# Altium project EL6905.PrjPcb
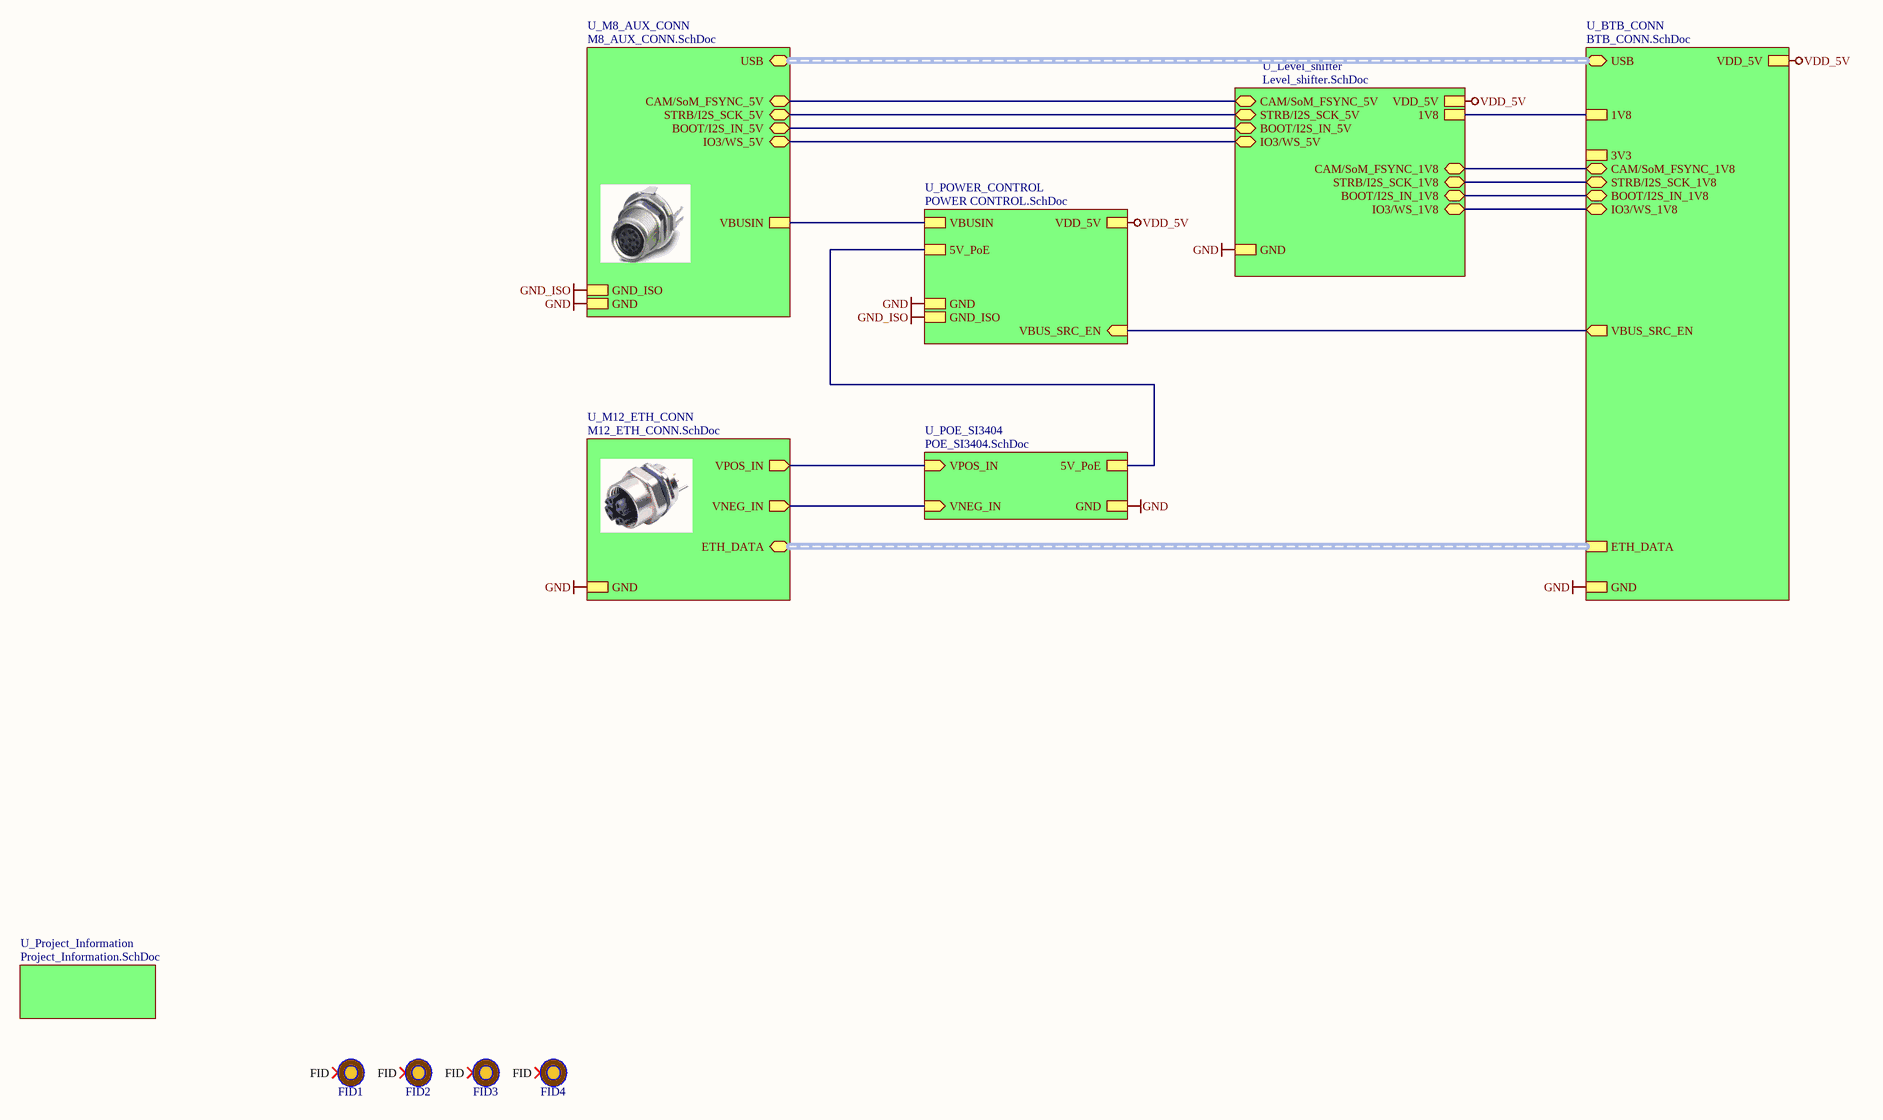
[diagram p0: TopLevel.SchDoc]
document_number: D2088000; drawn_by: Eason Lin; project_title: EL6905; revision: R0M0E0
6 sheets, 29 parts. Net scope: strictly hierarchical (ports join the sheet entries above them; power ports are local).
Board file: EL6905.PcbDoc
Sheets:
  TopLevel.SchDoc
    U_Project_Information = Project_Information.SchDoc
    U_M12_ETH_CONN = M12_ETH_CONN.SchDoc
    U_M8_AUX_CONN = M8_AUX_CONN.SchDoc
    U_BTB_CONN = BTB_CONN.SchDoc
    U_Level_shifter = Level_shifter.SchDoc

## Sheet TopLevel.SchDoc: =project_title
size Tabloid; CompanyName: Luxonis Holding; DrawnBy: Eason Lin; Organization: Luxonis Holding; Address1: 1925 Harmony Park Drive; Address2: Westminster, CO; Address3: 80234; Address4: United States; DocumentNumber: D2088000; Revision: R0M0E0; SheetNumber: 1; SheetTotal: 8

### Parts
FID1  FIDUCIAL_ROUND_1MM  [FIDUCIAL_ROUND_1MM]  (value not drawn)  (no BOM)
FID2  FIDUCIAL_ROUND_1MM  [FIDUCIAL_ROUND_1MM]  (value not drawn)  (no BOM)
FID3  FIDUCIAL_ROUND_1MM  [FIDUCIAL_ROUND_1MM]  (value not drawn)  (no BOM)
FID4  FIDUCIAL_ROUND_1MM  [FIDUCIAL_ROUND_1MM]  (value not drawn)  (no BOM)

### Sub-sheets
U_BTB_CONN = BTB_CONN.SchDoc: VBUS_SRC_EN (out), GND, ETH_DATA (harness ETH_DATA), VDD_5V, 1V8, USB (bidir, harness USB), 3V3, CAM/SoM_FSYNC_1V8 (bidir), STRB/I2S_SCK_1V8 (bidir), BOOT/I2S_IN_1V8 (bidir), IO3/WS_1V8 (bidir)
U_Level_shifter = Level_shifter.SchDoc: VDD_5V, 1V8, GND, CAM/SoM_FSYNC_5V (bidir), STRB/I2S_SCK_5V (bidir), BOOT/I2S_IN_5V (bidir), IO3/WS_5V (bidir), CAM/SoM_FSYNC_1V8 (bidir), STRB/I2S_SCK_1V8 (bidir), BOOT/I2S_IN_1V8 (bidir), IO3/WS_1V8 (bidir)
U_M8_AUX_CONN = M8_AUX_CONN.SchDoc: GND, VBUSIN, USB (bidir, harness USB), GND_ISO, CAM/SoM_FSYNC_5V (bidir), STRB/I2S_SCK_5V (bidir), BOOT/I2S_IN_5V (bidir), IO3/WS_5V (bidir)
U_M12_ETH_CONN = M12_ETH_CONN.SchDoc: VPOS_IN (out), VNEG_IN (out), ETH_DATA (bidir, harness ETH_DATA), GND
U_POE_SI3404 = POE_SI3404.SchDoc (file not in this document): 5V_PoE, GND, VPOS_IN (in), VNEG_IN (in)
U_POWER_CONTROL = POWER CONTROL.SchDoc (file not in this document): VDD_5V, GND_ISO, GND, 5V_PoE, VBUSIN, VBUS_SRC_EN (in)
U_Project_Information = Project_Information.SchDoc: no entries

### Nets
1V8: sheet U_BTB_CONN/1V8, sheet U_Level_shifter/1V8
GND: sheet U_M12_ETH_CONN/GND, sheet U_POE_SI3404/GND, sheet U_M8_AUX_CONN/GND, sheet U_BTB_CONN/GND, sheet U_POWER_CONTROL/GND, sheet U_Level_shifter/GND
GND_ISO: sheet U_M8_AUX_CONN/GND_ISO, sheet U_POWER_CONTROL/GND_ISO
VBUSIN: sheet U_M8_AUX_CONN/VBUSIN, sheet U_POWER_CONTROL/VBUSIN
VDD_5V: sheet U_BTB_CONN/VDD_5V, sheet U_POWER_CONTROL/VDD_5V, sheet U_Level_shifter/VDD_5V
BOOT/I2S_IN_1V8: sheet U_BTB_CONN/BOOT/I2S_IN_1V8, sheet U_Level_shifter/BOOT/I2S_IN_1V8
BOOT/I2S_IN_5V: sheet U_M8_AUX_CONN/BOOT/I2S_IN_5V, sheet U_Level_shifter/BOOT/I2S_IN_5V
CAM/SoM_FSYNC_1V8: sheet U_BTB_CONN/CAM/SoM_FSYNC_1V8, sheet U_Level_shifter/CAM/SoM_FSYNC_1V8
CAM/SoM_FSYNC_5V: sheet U_M8_AUX_CONN/CAM/SoM_FSYNC_5V, sheet U_Level_shifter/CAM/SoM_FSYNC_5V
IO3/WS_1V8: sheet U_BTB_CONN/IO3/WS_1V8, sheet U_Level_shifter/IO3/WS_1V8
IO3/WS_5V: sheet U_M8_AUX_CONN/IO3/WS_5V, sheet U_Level_shifter/IO3/WS_5V
STRB/I2S_SCK_1V8: sheet U_BTB_CONN/STRB/I2S_SCK_1V8, sheet U_Level_shifter/STRB/I2S_SCK_1V8
STRB/I2S_SCK_5V: sheet U_M8_AUX_CONN/STRB/I2S_SCK_5V, sheet U_Level_shifter/STRB/I2S_SCK_5V
VNEG_IN: sheet U_M12_ETH_CONN/VNEG_IN, sheet U_POE_SI3404/VNEG_IN
VPOS_IN: sheet U_M12_ETH_CONN/VPOS_IN, sheet U_POE_SI3404/VPOS_IN
NetJ1_28: sheet U_BTB_CONN/VBUS_SRC_EN, sheet U_POWER_CONTROL/VBUS_SRC_EN
(unnamed): sheet U_POE_SI3404/5V_PoE, sheet U_POWER_CONTROL/5V_PoE

Not connected (* = marked no-connect by the designer): FID1 FID*; FID2 FID*; FID3 FID*; FID4 FID*

### Buses and harness runs
harness sheet U_BTB_CONN/ETH_DATA = sheet U_M12_ETH_CONN/ETH_DATA
harness sheet U_BTB_CONN/USB = sheet U_M8_AUX_CONN/USB

### Notes on the sheet
- Title
- Size:
- Date:
- Tabloid
- Number:
- Time:
- Revision:
- Sheet
- of
- Drawn by:

### Library data of the parts
FID1-FID4 = FIDUCIAL: Fiducial with various available footprints

## Sheet Project_Information.SchDoc: =project_title
size Tabloid; CompanyName: Luxonis Holding; DrawnBy: Eason Lin; Organization: Luxonis Holding; Address1: 1925 Harmony Park Drive; Address2: Westminster, CO; Address3: 80234; Address4: United States; DocumentNumber: D2088000; Revision: R0M0E0
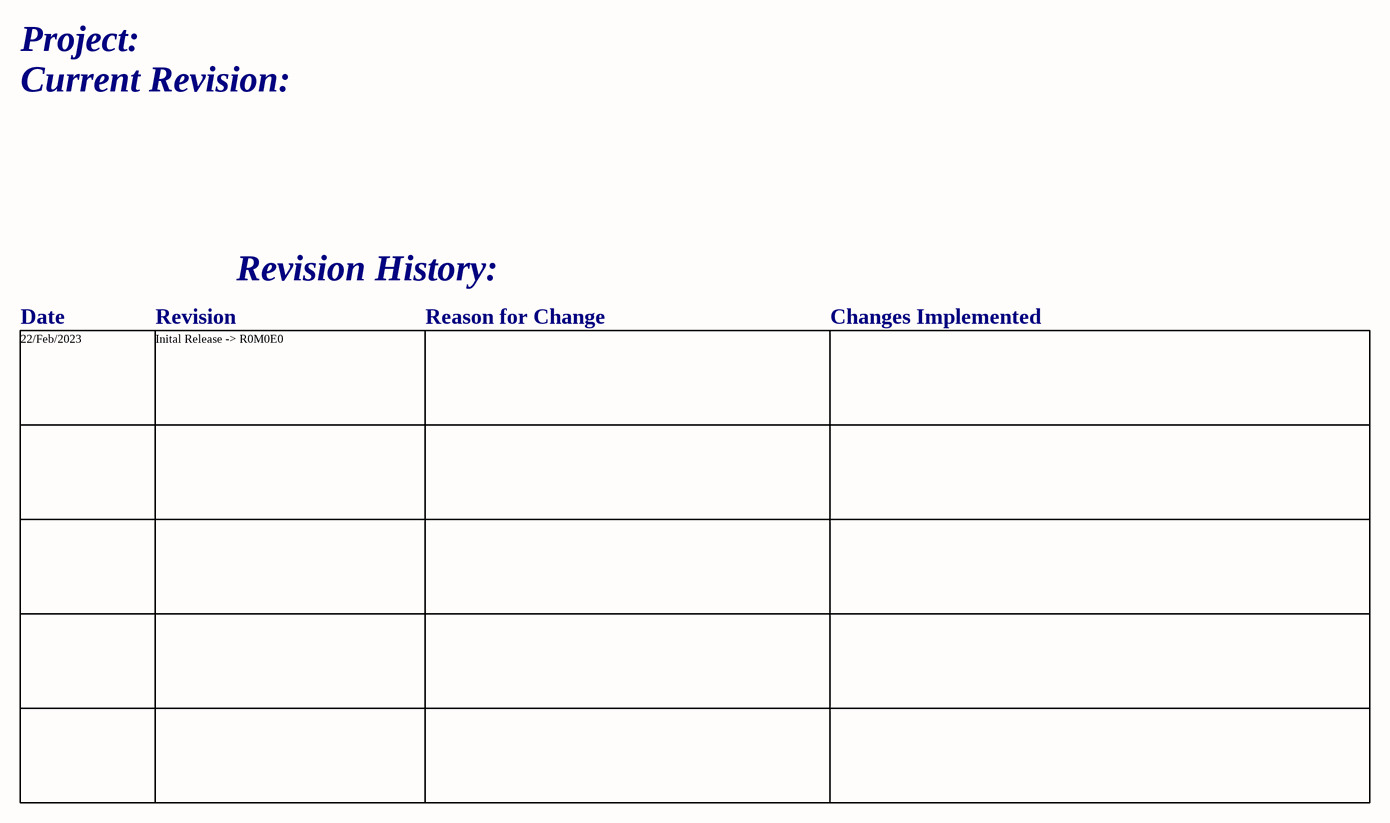
[diagram p1: Project_Information.SchDoc]

### Notes on the sheet
- Project:
- Current Revision:
- Revision History:
- Date
- Revision
- Reason for Change
- Changes Implemented
- 22/Feb/2023
- Inital Release -> R0M0E0
- Title
- Size:
- Date:
- Tabloid
- Number:
- Time:
- Revision:
- Sheet
- of
- Drawn by:

## Sheet M12_ETH_CONN.SchDoc: =project_title
size Tabloid; CompanyName: Luxonis Holding; DrawnBy: Eason Lin; Organization: Luxonis Holding; Address1: 1925 Harmony Park Drive; Address2: Westminster, CO; Address3: 80234; Address4: United States; DocumentNumber: D2088000; Revision: R0M0E0; SheetNumber: 6; SheetTotal: 8
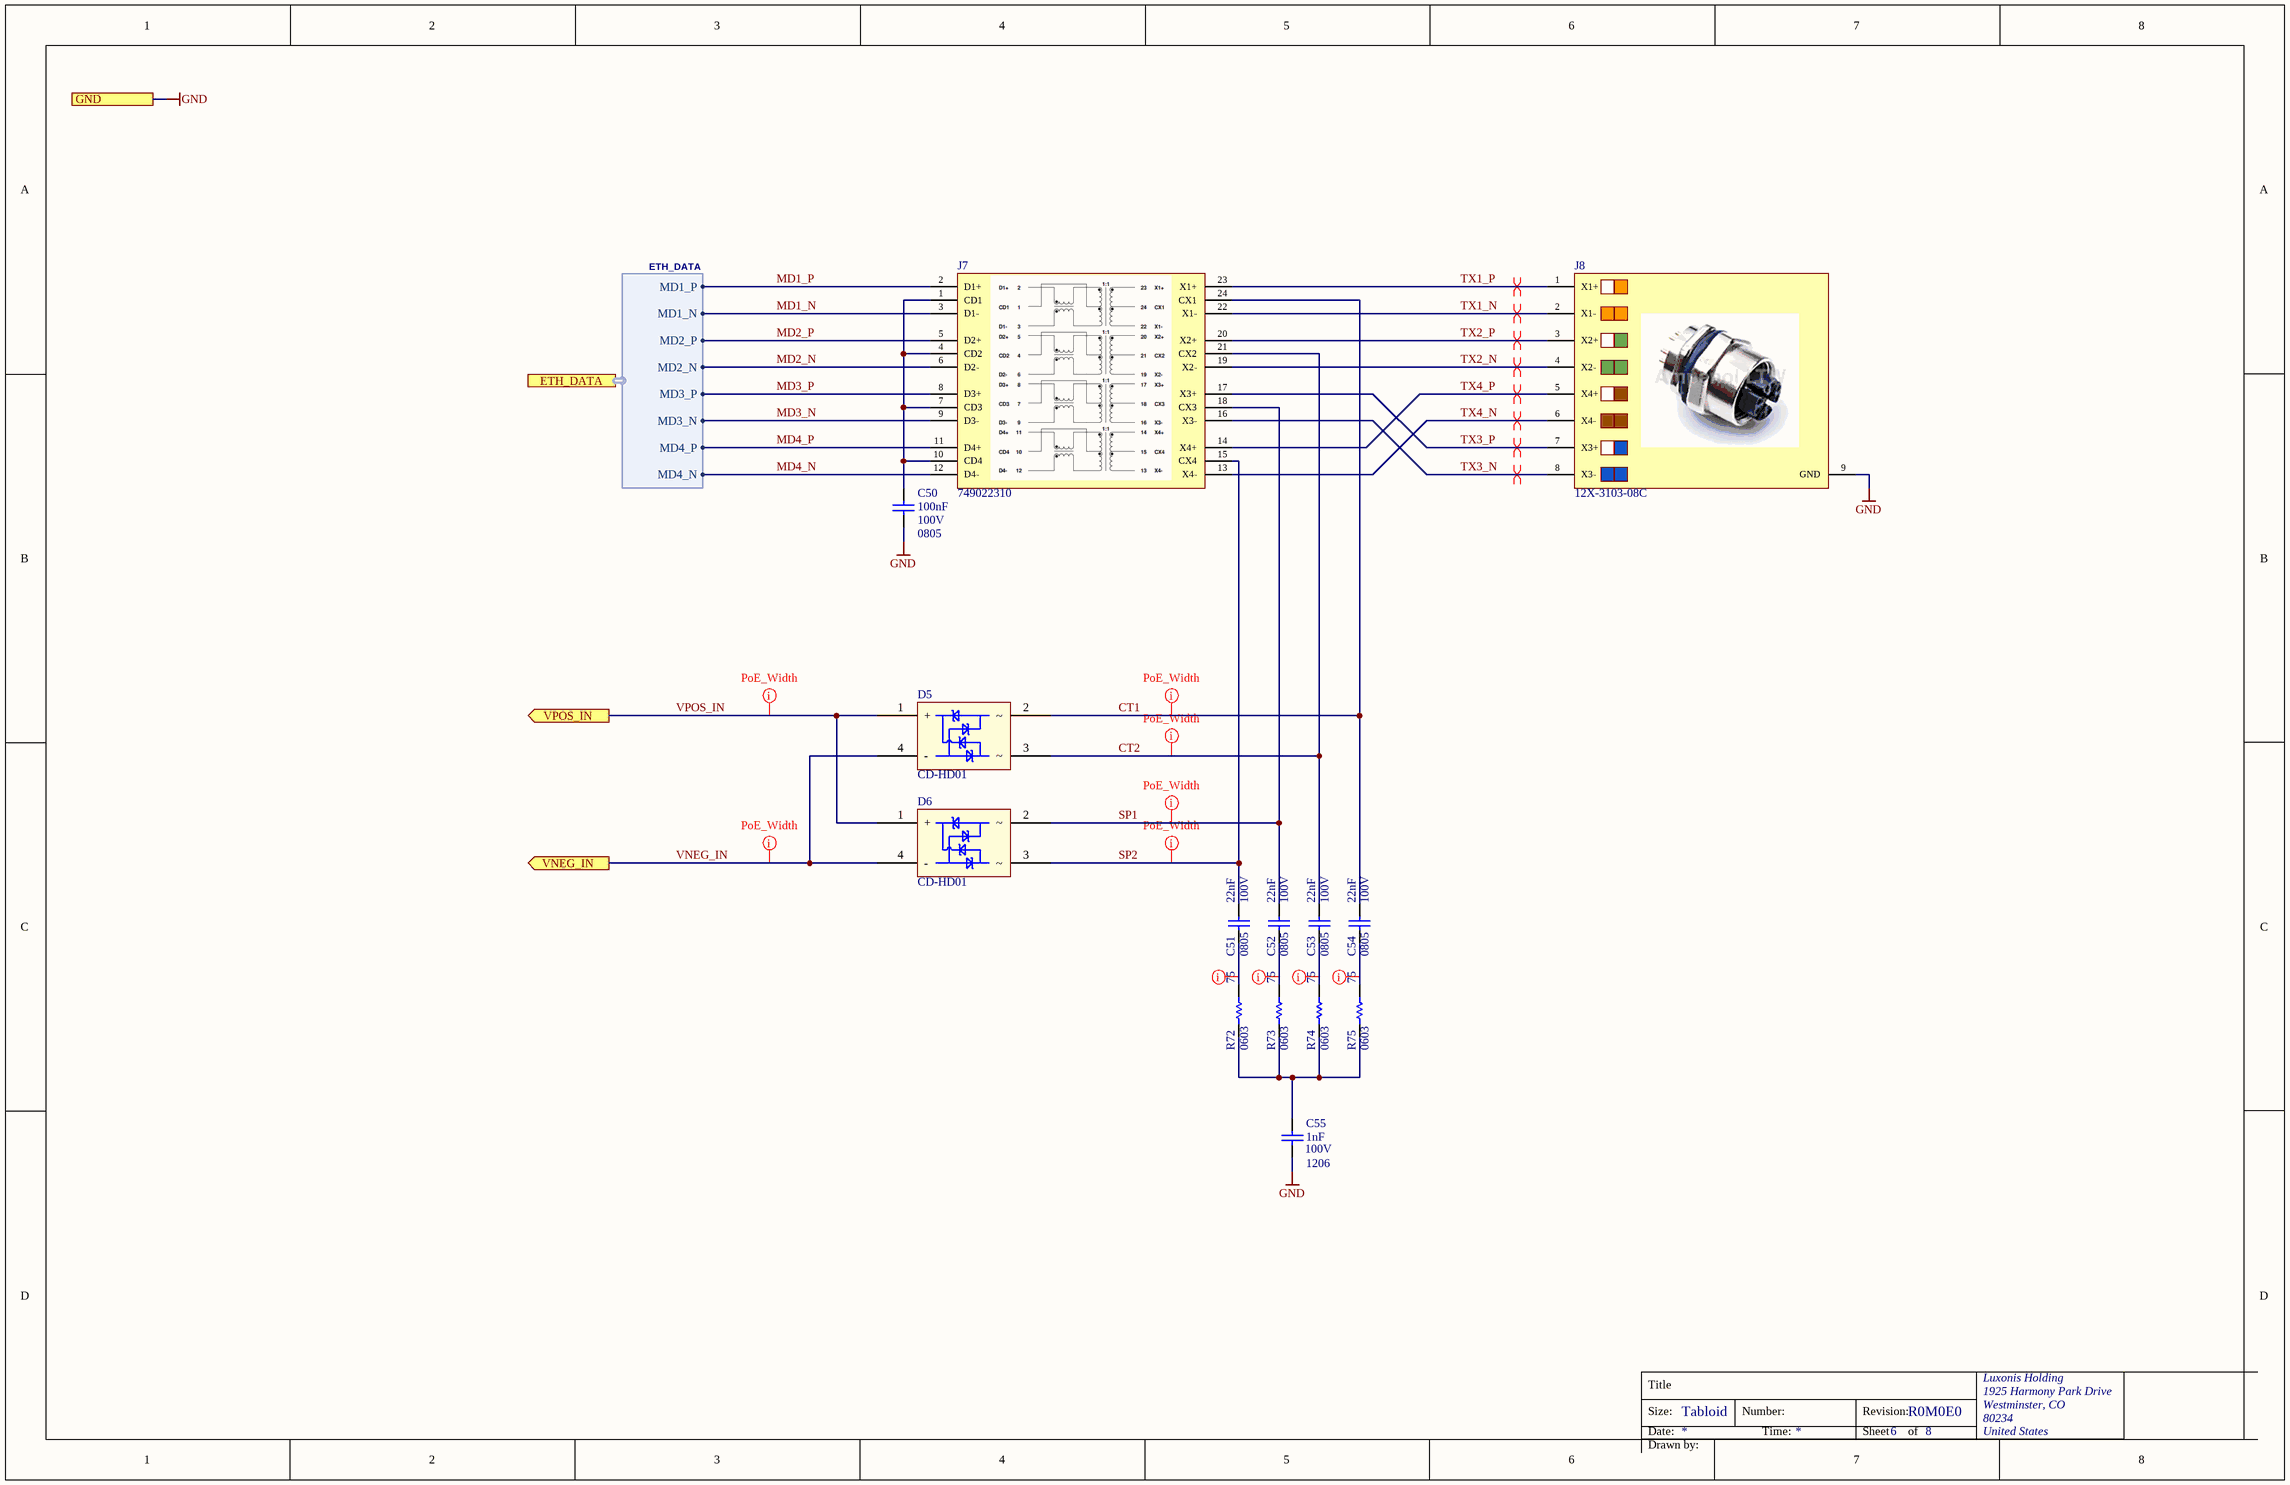
[diagram p2: M12_ETH_CONN.SchDoc]

### Parts
C50  value 100nF  Voltage Rating: 100V  Case/Package: 0805  [CAPC0805(2012)145_N]  (hidden comment: CL21B104KCFNNNE)
C51  value 22nF  Voltage Rating: 100V  Case/Package: 0805  [CAPC0805(2012)145_L]  (hidden comment: C0805C223M1RACAUTO)
C52  value 22nF  Voltage Rating: 100V  Case/Package: 0805  [CAPC0805(2012)145_L]  (hidden comment: C0805C223M1RACAUTO)
C53  value 22nF  Voltage Rating: 100V  Case/Package: 0805  [CAPC0805(2012)145_L]  (hidden comment: C0805C223M1RACAUTO)
C54  value 22nF  Voltage Rating: 100V  Case/Package: 0805  [CAPC0805(2012)145_L]  (hidden comment: C0805C223M1RACAUTO)
C55  value 1nF  Voltage Rating: 100V  Case/Package: 1206  [CAPC1206(3216)130_L]  (hidden comment: C1206C102KGRACTU)
D5  CD-HD01  [CD-H01]
D6  CD-HD01  [CD-H01]
J7  749022310  [749022310]
J8  12X-3103-08C  [12X-3103-08C]
R72  value 75  Case/Package: 0603  [RESC0603(1608)_N]  (hidden comment: ERJ-UP3F75R0V)
R73  value 75  Case/Package: 0603  [RESC0603(1608)_N]  (hidden comment: ERJ-UP3F75R0V)
R74  value 75  Case/Package: 0603  [RESC0603(1608)_N]  (hidden comment: ERJ-UP3F75R0V)
R75  value 75  Case/Package: 0603  [RESC0603(1608)_N]  (hidden comment: ERJ-UP3F75R0V)

### Ports
ETH_DATA (harness ETH_DATA), GND, VNEG_IN (out), VPOS_IN (out)

### Harnesses
ETH_DATA: MD1_P, MD1_N, MD2_P, MD2_N, MD3_P, MD3_N, MD4_P, MD4_N

### Nets
GND: C50.1 C55.1 J8.9(GND) ; port GND
CT1: C54.2 D5.2 J7.24(CX1)
CT2: C53.2 D5.3 J7.21(CX2)
MD1_N: J7.3(D1-) ; port ETH_DATA.MD1_N
MD1_P: J7.2(D1+) ; port ETH_DATA.MD1_P
MD2_N: J7.6(D2-) ; port ETH_DATA.MD2_N
MD2_P: J7.5(D2+) ; port ETH_DATA.MD2_P
MD3_N: J7.9(D3-) ; port ETH_DATA.MD3_N
MD3_P: J7.8(D3+) ; port ETH_DATA.MD3_P
MD4_N: J7.12(D4-) ; port ETH_DATA.MD4_N
MD4_P: J7.11(D4+) ; port ETH_DATA.MD4_P
SP1: C52.2 D6.2 J7.18(CX3)
SP2: C51.2 D6.3 J7.15(CX4)
TX1_N: J7.22(X1-) J8.2(X1-)
TX1_P: J7.23(X1+) J8.1(X1+)
TX2_N: J7.19(X2-) J8.4(X2-)
TX2_P: J7.20(X2+) J8.3(X2+)
TX3_N: J7.16(X3-) J8.8(X3-)
TX3_P: J7.17(X3+) J8.7(X3+)
TX4_N: J7.13(X4-) J8.6(X4-)
TX4_P: J7.14(X4+) J8.5(X4+)
VNEG_IN: D5.4(-) D6.4(-) ; port VNEG_IN
VPOS_IN: D5.1(+) D6.1(+) ; port VPOS_IN
NetC50_2: C50.2 J7.1(CD1) J7.4(CD2) J7.7(CD3) J7.10(CD4)
NetC51_1: C51.1 R72.2
NetC52_1: C52.1 R73.2
NetC53_1: C53.1 R74.2
NetC54_1: C54.1 R75.2
NetC55_2: C55.2 R72.1 R73.1 R74.1 R75.1

### Layout directives
differential pair; differential pair class 100ohm: TX1_N, TX1_P, TX2_N, TX2_P, TX3_N, TX3_P, TX4_N, TX4_P
rule Width Constraint [Pref Width = 15mil    Min Width = 4mil    Max Width = 50mil]; net class PoE: CT1, CT2, NetC51_1, NetC52_1, NetC53_1, NetC54_1, SP1, SP2, VNEG_IN, VPOS_IN

### Notes on the sheet
- Title
- Size:
- Date:
- Tabloid
- Number:
- Time:
- Revision:
- Sheet
- of
- Drawn by:

### Library data of the parts
C50 = CMP-108-000003-5: CAP CER 0.1UF 100V X7R 0805 10%; Manufacturer 1: Samsung; Dielectric: X7R; Manufacturer Part Number 1: CL21B104KCFNNNE; Length: 2mm; Width: 0.049inch; Max Operating Temperature: 125°C; Mounting Technology: SMT; ComponentLink1Description: https://datasheet.ciiva.com/26936/getdatasheetpartid-781823-26936904.pdf?src-supplier=Verical; Depth: 1.25mm; Min Operating Temperature: -55°C; ComponentLink1URL: https://datasheet.ciiva.com/26936/getdatasheetpartid-781823-26936904.pdf?src-supplier=Verical; Design Item ID: CL21B104KCFNNNE; Tolerance: 10%
C51-C54 = CMP-004-000002-5: CAP CER 22nF 100V X7R 0805 20%; Manufacturer 1: KEMET; Capacitor Type: Ceramic; ComponentLink2URL: http://components.arrow.com/part/dataview/0323_00327945?src-supplier=Arrow+Europe; Manufacturer Part Number 1: C0805C223M1RACAUTO; ComponentLink2Description: http://components.arrow.com/part/dataview/0323_00327945?src-supplier=Arrow+Europe; ComponentLink5URL: https://api.kemet.com/component-edge/download/datasheet/C0805C223M1RACAUTO.pdf?src-supplier=Digi-Key; Min Operating Temperature: -55°C; Width: 1.25mm; Height: 0.9mm; Design Item ID: C0805C223M1RACAUTO; Tolerance: 20%; ComponentLink4Description: http://www.kemet.com/docfinder?Partnumber=C0805C223M1RACAUTO&src-supplier=Digi-Key; Dielectric: X7R; ComponentLink5Description: https://api.kemet.com/component-edge/download/datasheet/C0805C223M1RACAUTO.pdf?src-supplier=Digi-Key; ComponentLink3Description: http://capacitoredge.kemet.com/capedge2/DataSheet/Datasheet-C0805C223M1RACAUTO.pdf?pn=C0805C223M1RACAUTO&src-supplier=Avnet; ComponentLink4URL: http://www.kemet.com/docfinder?Partnumber=C0805C223M1RACAUTO&src-supplier=Digi-Key; Mounting Technology: SMT; ComponentLink3URL: http://capacitoredge.kemet.com/capedge2/DataSheet/Datasheet-C0805C223M1RACAUTO.pdf?pn=C0805C223M1RACAUTO&src-supplier=Avnet; ComponentLink1URL: https://datasheet.ciiva.com:443/pdfs/VipMasterIC/IC/KEME/KEME-S-A0009891634/KEME-S-A0009891634-1.pdf?src-supplier=IHS+Markit; ComponentLink1Description: https://datasheet.ciiva.com:443/pdfs/VipMasterIC/IC/KEME/KEME-S-A0009891634/KEME-S-A0009891634-1.pdf?src-supplier=IHS+Markit; Length: 2mm; Max Operating Temperature: 125°C
C55 = CMP-004-000001-5: CAP CER 1nF 2000V X7R 1206 10%; Manufacturer 1: KEMET; Capacitor Type: Ceramic; Manufacturer Part Number 1: C1206C102KGRACTU; Min Operating Temperature: -55°C; Height: 1.6mm; ComponentLink2URL: https://datasheet.ciiva.com/18194/getdatasheetpartid-359031-18194095.pdf?src-supplier=Verical; ComponentLink4URL: https://datasheet.ciiva.com/28672/1807957-28672854.pdf?src-supplier=Element14; ComponentLink1Description: https://datasheet.ciiva.com:443/pdfs/VipMasterIC/IC/KEME/KEME-S-A0007617657/KEME-S-A0007567533-1.pdf?src-supplier=IHS+Markit; ComponentLink2Description: https://datasheet.ciiva.com/18194/getdatasheetpartid-359031-18194095.pdf?src-supplier=Verical; Dielectric: X7R; Width: 1.6mm; Length: 3.2mm; ComponentLink1URL: https://datasheet.ciiva.com:443/pdfs/VipMasterIC/IC/KEME/KEME-S-A0007617657/KEME-S-A0007567533-1.pdf?src-supplier=IHS+Markit; Design Item ID: C1206C102KGRACTU; ComponentLink3Description: https://datasheet.ciiva.com/28610/1372242-28610895.pdf?src-supplier=Element14; Max Operating Temperature: 125°C; ComponentLink4Description: https://datasheet.ciiva.com/28672/1807957-28672854.pdf?src-supplier=Element14; ComponentLink3URL: https://datasheet.ciiva.com/28610/1372242-28610895.pdf?src-supplier=Element14; Mounting Technology: SMT; Tolerance: 10%
D5 D6 = CMP-004-00050-1: CD-HD0x Series Schottky Bridge Rectifier Diode 100V 4-Pin Surface Mount T/R; Manufacturer 1: Bourns; Average Rectified Current: 1A; Source: NG9097_test.SchLib; RoHS: No; Pricing 1: 1=0.61000, 10=0.52500, 100=0.36400, 500=0.28420, 1000=0.23100, 2000=0.21700 (USD); Packaging: Tape and Reel; Mount: Surface Mount; Design Item ID: CD-HD01; Stock 1: 15383; Min Operating Temperature: -55°C; Manufacturer Part Number 1: CD-HD01; Max Operating Temperature: 125°C
J7 = CMP-012-00001-3: WE-LAN AQ SMT Transformer, 1000 Base-T, PoE+ (up to 720 mA), 150uH; Manufacturer 1: Wurth Elektronik; Manufacturer Part Number 1: 749022310; Design Item ID: 749022310
J8 = CMP-002-00115-2: Conn M12 Circular F 8 POS Solder ST Thru-Hole 8 Terminal 1 Port; Manufacturer 1: KingTop; Stock 1: 703; ComponentLink1URL: http://www.farnell.com/datasheets/1945922.pdf?src-supplier=Element14; ComponentLink1Description: http://www.farnell.com/datasheets/1945922.pdf?src-supplier=Element14; Source: NG9097.SchLib; Manufacturer Part Number 1: 12X-3103-08C; Pins: 8; Pricing 1: 1=10,44000, 10=9,39800, 25=8,85280, 50=8,62600, 100=8,39900, 250=7,49100, 500=7,03700, 1000=6,35600 (USD); RoHS: No; Design Item ID: 12X-3103-08C; ComponentLink2Description: http://www.farnell.com/datasheets/1879376.pdf?src-supplier=Element14; ComponentLink2URL: http://www.farnell.com/datasheets/1879376.pdf?src-supplier=Element14; Category: Circular Connectors
R72-R75 = CMP-013-000003-8: RES SMD 75 OHM 150V 1% 1/10W 0603; Manufacturer 1: Panasonic; Manufacturer Part Number 1: ERJ-UP3F75R0V; Design Item ID: ERJ-UP3F75R0V

## Sheet M8_AUX_CONN.SchDoc: =project_title
size Tabloid; CompanyName: Luxonis Holding; DrawnBy: Eason Lin; Organization: Luxonis Holding; Address1: 1925 Harmony Park Drive; Address2: Westminster, CO; Address3: 80234; Address4: United States; DocumentNumber: D2088000; Revision: R0M0E0; SheetNumber: 8; SheetTotal: 8
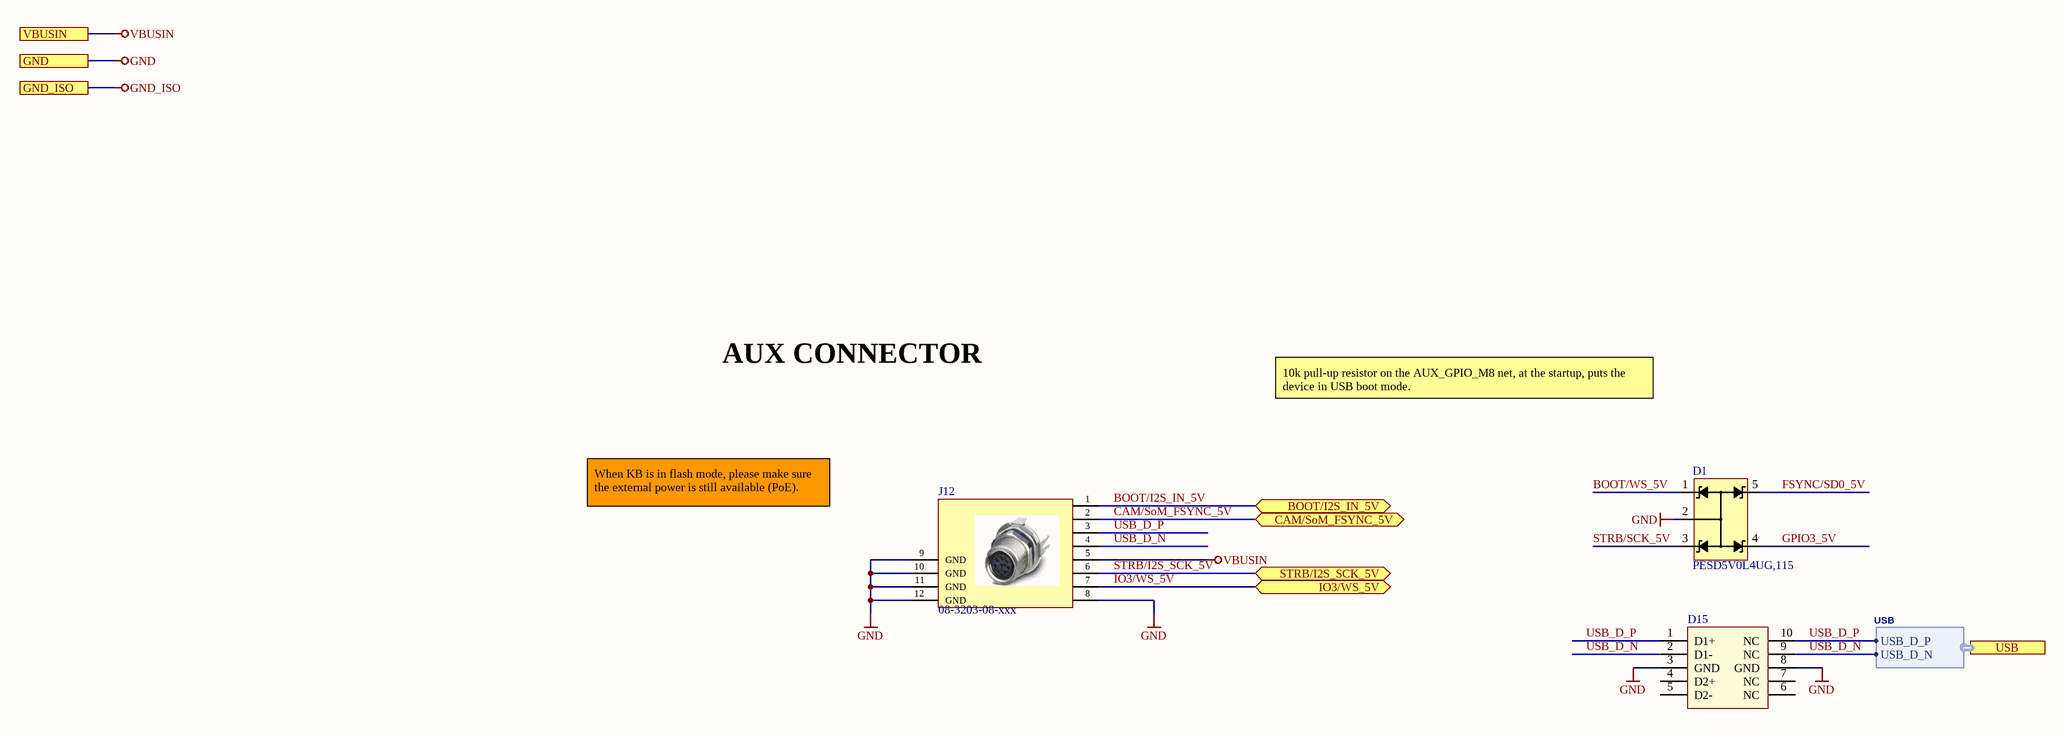
[diagram p3: M8_AUX_CONN.SchDoc]

### Parts
D1  PESD5V0L4UG,115  [PESD3V3L4UG,115]
D15  TPD4EUSB30DQAR  [TPD4EUSB30DQAR]  (value not drawn)
J12  08-3203-08-xxx  [08-3203-08-XXX]

### Ports
BOOT/I2S_IN_5V (bidir), CAM/SoM_FSYNC_5V (bidir), GND, GND_ISO, IO3/WS_5V (bidir), STRB/I2S_SCK_5V (bidir), USB (harness USB), VBUSIN

### Harnesses
USB: USB_D_P, USB_D_N

### Nets
GND: D1.2 D15.3(GND) D15.8(GND) J12.8 J12.9(GND) J12.10(GND) J12.11(GND) J12.12(GND) ; port GND
VBUSIN: J12.5 ; port VBUSIN
BOOT/I2S_IN_5V: J12.1 ; port BOOT/I2S_IN_5V
BOOT/WS_5V: D1.1
CAM/SoM_FSYNC_5V: J12.2 ; port CAM/SoM_FSYNC_5V
FSYNC/SD0_5V: D1.5
GPIO3_5V: D1.4
IO3/WS_5V: J12.7 ; port IO3/WS_5V
STRB/I2S_SCK_5V: J12.6 ; port STRB/I2S_SCK_5V
STRB/SCK_5V: D1.3
USB_D_N: D15.2(D1-) D15.9(NC) J12.4 ; port USB.USB_D_N
USB_D_P: D15.1(D1+) D15.10(NC) J12.3 ; port USB.USB_D_P

Not connected (* = marked no-connect by the designer): D15 4(D2+) 5(D2-) 6(NC) 7(NC)

### Notes on the sheet
- AUX CONNECTOR
- 10k pull-up resistor on the AUX_GPIO_M8 net, at the startup, puts the device in USB boot mode.
- When KB is in flash mode, please make sure the external power is still available (PoE).
- Title
- Size:
- Date:
- Tabloid
- Number:
- Time:
- Revision:
- Sheet
- of
- Drawn by:

### Library data of the parts
D1 = CMP-097-000002-2: TVS DIODE 5V 12V 5TSSOP; Manufacturer 1: Nexperia; Manufacturer Part Number 1: PESD5V0L4UG,115; Category: ESD and Circuit Protection ICs
D15 = CMP-008-000011-2: TVS DIODE 5.5V 8V 10SON 8V Clamp 1A (8/20µs) Ipp Tvs Diode Surface Mount 10-USON (2.5x1); Manufacturer 1: Texas Instruments; Forward Current: 5A; Manufacturer Part Number 1: TPD4EUSB30DQAR; Min Operating Temperature: -40°C; Max Operating Temperature: 85°C; Clamping Voltage: 8V
J12 = CMP-002-00116-2: M8 Circular Connector; Manufacturer 1: KingTop; RoHS: Yes; Category: Circular Connectors; Contact Finish - Mating: NOT SPECIFIED; Connector Type: Circular; REACH SVHC: No SVHC; RoHS Compliant: Yes; ComponentLink1URL: https://datasheet.ciiva.com:443/pdfs/VipMasterIC/IC/PCON/PCON-S-A0001961096/PCON-S-A0001960825-1.pdf?src-supplier=IHS+Markit; ComponentLink1Description: https://datasheet.ciiva.com:443/pdfs/VipMasterIC/IC/PCON/PCON-S-A0001961096/PCON-S-A0001960825-1.pdf?src-supplier=IHS+Markit; ComponentLink2URL: https://datasheet.ciiva.com/29221/1456132-29221494.pdf?src-supplier=Digi-Key; ComponentLink2Description: https://datasheet.ciiva.com/29221/1456132-29221494.pdf?src-supplier=Digi-Key; ComponentLink3URL: https://datasheet.ciiva.com/41451/718258-da-01-de-sens-akt-einbaubuch-6pol-1456132-20-st-41451463.pdf?src-supplier=Conrad; ComponentLink3Description: https://datasheet.ciiva.com/41451/718258-da-01-de-sens-akt-einbaubuch-6pol-1456132-20-st-41451463.pdf?src-supplier=Conrad; Manufacturer Part Number 1: 08-3203-08-XXX; Stock 1: 11; Pricing 1: 1=26,56000, 10=24,43500, 50=22,57600, 100=21,51360, 250=20,18568 (USD); Design Item ID: 08-3203-08-xxx; Source: NG9097.SchLib; Pins: 8

## Sheet BTB_CONN.SchDoc: =project_title
size Tabloid; CompanyName: Luxonis Holding; DrawnBy: Eason Lin; Organization: Luxonis Holding; Address1: 1925 Harmony Park Drive; Address2: Westminster, CO; Address3: 80234; Address4: United States; DocumentNumber: D2088000; Revision: R0M0E0; SheetNumber: 3; SheetTotal: 8
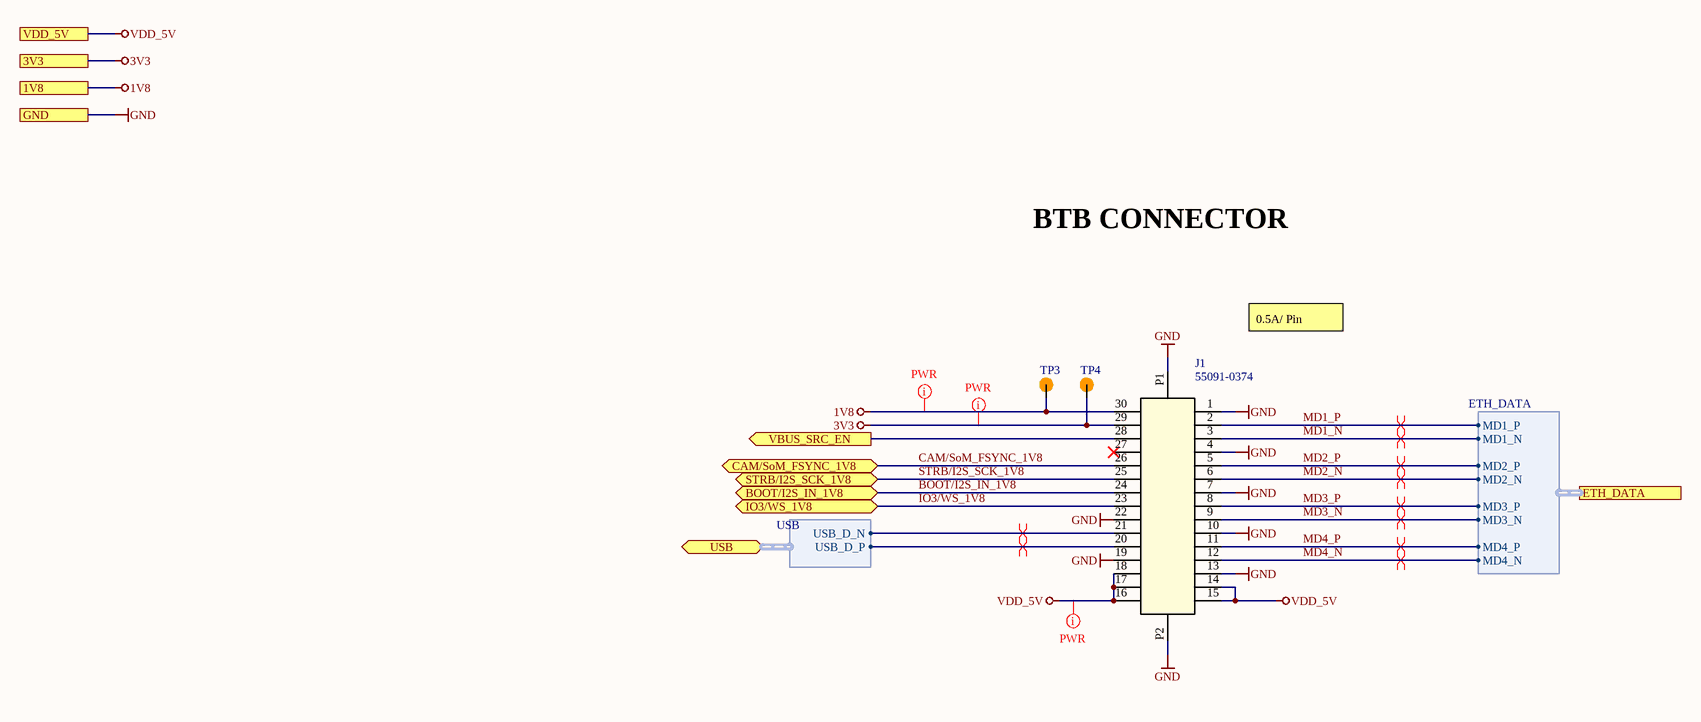
[diagram p4: BTB_CONN.SchDoc]

### Parts
J1  55091-0374  [CON_550910374]
TP3  TP100_200_NS  [TP075_150_NS]  (value not drawn)  (no BOM)
TP4  TP100_200_NS  [TP075_150_NS]  (value not drawn)  (no BOM)

### Ports
1V8, 3V3, BOOT/I2S_IN_1V8 (bidir), CAM/SoM_FSYNC_1V8 (bidir), ETH_DATA (harness ETH_DATA), GND, IO3/WS_1V8 (bidir), STRB/I2S_SCK_1V8 (bidir), USB (bidir, harness USB), VBUS_SRC_EN (out), VDD_5V

### Harnesses
ETH_DATA: MD1_P, MD1_N, MD2_P, MD2_N, MD3_P, MD3_N, MD4_P, MD4_N
USB: USB_D_P, USB_D_N

### Nets
1V8: J1.30 TP3.1 ; port 1V8
3V3: J1.29 TP4.1 ; port 3V3
GND: J1.1 J1.4 J1.7 J1.10 J1.13 J1.19 J1.22 J1.P1 J1.P2 ; port GND
VDD_5V: J1.14 J1.15 J1.16 J1.17 J1.18 ; port VDD_5V
BOOT/I2S_IN_1V8: J1.24 ; port BOOT/I2S_IN_1V8
CAM/SoM_FSYNC_1V8: J1.26 ; port CAM/SoM_FSYNC_1V8
IO3/WS_1V8: J1.23 ; port IO3/WS_1V8
MD1_N: J1.3 ; port ETH_DATA.MD1_N
MD1_P: J1.2 ; port ETH_DATA.MD1_P
MD2_N: J1.6 ; port ETH_DATA.MD2_N
MD2_P: J1.5 ; port ETH_DATA.MD2_P
MD3_N: J1.9 ; port ETH_DATA.MD3_N
MD3_P: J1.8 ; port ETH_DATA.MD3_P
MD4_N: J1.12 ; port ETH_DATA.MD4_N
MD4_P: J1.11 ; port ETH_DATA.MD4_P
STRB/I2S_SCK_1V8: J1.25 ; port STRB/I2S_SCK_1V8
USB_D_N: J1.21 ; port USB.USB_D_N
USB_D_P: J1.20 ; port USB.USB_D_P
NetJ1_28: J1.28 ; port VBUS_SRC_EN

Not connected (* = marked no-connect by the designer): J1 27*

### Layout directives
differential pair; net class USB2; differential pair class 85ohm: USB_D_N, USB_D_P
differential pair; net class ETH; differential pair class 100ohm: MD1_N, MD1_P, MD2_N, MD2_P, MD3_N, MD3_P, MD4_N, MD4_P
net class PWR; Current Rating: 3A: VDD_5V
net class PWR; Current Rating: 100mA: 1V8, 3V3

### Notes on the sheet
- BTB CONNECTOR
- 0.5A/ Pin
- Title
- Size:
- Date:
- Tabloid
- Number:
- Time:
- Revision:
- Sheet
- of
- Drawn by:

### Library data of the parts
J1 = CMP-00021-4: CONN, Board-to-Board Connector, Mezzanine, 0.635mm pitch, 2x15, 30 positions, Receptacle, Mated height 12mm; Manufacturer 1: Molex; Max Current Rating: 500mA; Voltage Rating: 100V; Manufacturer Part Number 1: 55091-0374; Max Operating Temperature: 105°C; Connector Type: Mezzanine; Gender: Receptacle; Min Operating Temperature: -55°C; Pins: 30; System: Connector
TP3 TP4 = CMP-015-000000-2: Manufacturer Part Number 1: /; Source: LuxonisMaster.SchLib; Design Item ID: TEST_POINT

## Sheet Level_shifter.SchDoc: =project_title
size Tabloid; CompanyName: Luxonis Holding; DrawnBy: Eason Lin; Organization: Luxonis Holding; Address1: 1925 Harmony Park Drive; Address2: Westminster, CO; Address3: 80234; Address4: United States; DocumentNumber: D2088000; Revision: R0M0E0; SheetNumber: 7; SheetTotal: 8
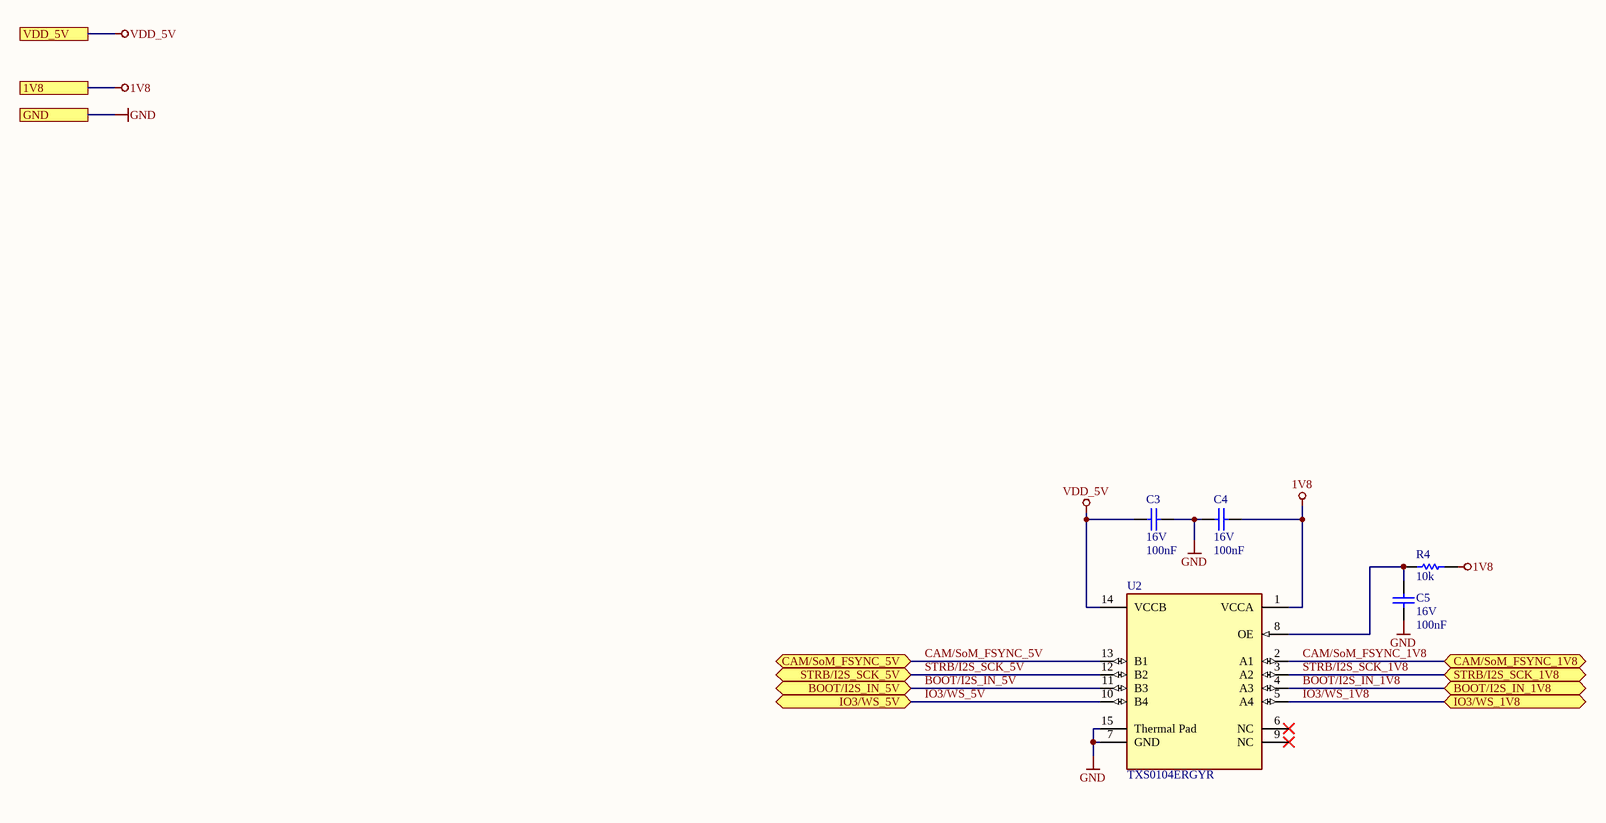
[diagram p5: Level_shifter.SchDoc]

### Parts
C3  value 100nF  Voltage Rating: 16V  [CAPC0402(1005)60_N]  (hidden comment: CL05B104KO5NFNC)
C4  value 100nF  Voltage Rating: 16V  [CAPC0402(1005)60_N]  (hidden comment: CL05B104KO5NFNC)
C5  value 100nF  Voltage Rating: 16V  [CAPC0402(1005)60_N]  (hidden comment: CL05B104KO5NFNC)
R4  value 10k  [RESC0402(1005)_N]  (hidden comment: RC0402FR-1310KL)
U2  TXS0104ERGYR  [FP-RGY0014A-MFG]

### Ports
1V8, BOOT/I2S_IN_1V8 (bidir), BOOT/I2S_IN_5V (bidir), CAM/SoM_FSYNC_1V8 (bidir), CAM/SoM_FSYNC_5V (bidir), GND, IO3/WS_1V8 (bidir), IO3/WS_5V (bidir), STRB/I2S_SCK_1V8 (bidir), STRB/I2S_SCK_5V (bidir), VDD_5V

### Nets
1V8: C4.2 R4.2 U2.1(VCCA) ; port 1V8
GND: C3.2 C4.1 C5.1 U2.7(GND) U2.15(Thermal_Pad) ; port GND
VDD_5V: C3.1 U2.14(VCCB) ; port VDD_5V
BOOT/I2S_IN_1V8: U2.4(A3) ; port BOOT/I2S_IN_1V8
BOOT/I2S_IN_5V: U2.11(B3) ; port BOOT/I2S_IN_5V
CAM/SoM_FSYNC_1V8: U2.2(A1) ; port CAM/SoM_FSYNC_1V8
CAM/SoM_FSYNC_5V: U2.13(B1) ; port CAM/SoM_FSYNC_5V
IO3/WS_1V8: U2.5(A4) ; port IO3/WS_1V8
IO3/WS_5V: U2.10(B4) ; port IO3/WS_5V
STRB/I2S_SCK_1V8: U2.3(A2) ; port STRB/I2S_SCK_1V8
STRB/I2S_SCK_5V: U2.12(B2) ; port STRB/I2S_SCK_5V
NetC5_2: C5.2 R4.1 U2.8(OE)

Not connected (* = marked no-connect by the designer): U2 6(NC)* 9(NC)*

### Notes on the sheet
- Title
- Size:
- Date:
- Tabloid
- Number:
- Time:
- Revision:
- Sheet
- of
- Drawn by:

### Library data of the parts
C3-C5 = CMP-108-000002-6: CAP CER 0.1UF 16V X7R 0402 10%; Manufacturer 1: Samsung; Dielectric: X7R; Mounting Technology: SMT; Width: 0.02inch; Design Item ID: CL05B104KO5NFNC; Tolerance: 10%; Length: 1mm; Case/Package: 0402; ComponentLink1URL: https://datasheet.ciiva.com/25767/cl05b104ko5nfnc-25767124.pdf?src-supplier=Digi-Key; Depth: 0.5mm; Min Operating Temperature: -55°C; Manufacturer Part Number 1: CL05B104KO5NFNC; ComponentLink1Description: https://datasheet.ciiva.com/25767/cl05b104ko5nfnc-25767124.pdf?src-supplier=Digi-Key; Height: 0.5mm; Max Operating Temperature: 125°C
R4 = CMP-115-000004-8: RES SMD 10K OHM 1% 1/16W 0402; Manufacturer 1: Yageo; Power Rating: 62.5mW; Temperature Coefficient: 100ppm/°C; Voltage Rating: 50V; Tolerance: 1%; Max Operating Temperature: 155°C; Case/Package: 0402; Manufacturer Part Number 1: RC0402FR-1310KL; Min Operating Temperature: -55°C; Design Item ID: RC0402FR-1310KL
U2 = CMP-015-00034-2: Interface Circuit, PQCC14; Pins: 14; Manufacturer Part Number 1: TXS0104ERGYR; Case/Package: HVQCCN

## Nets that join several sheets
1V8: BTB_CONN (J1.30 TP3.1), Level_shifter (C4.2 R4.2 U2.1)
GND: M12_ETH_CONN (C50.1 C55.1 J8.9), M8_AUX_CONN (8 pins), BTB_CONN (9 pins), Level_shifter (5 pins)
VDD_5V: BTB_CONN (5 pins), Level_shifter (C3.1 U2.14)
BOOT/I2S_IN_1V8: BTB_CONN (J1.24), Level_shifter (U2.4)
BOOT/I2S_IN_5V: M8_AUX_CONN (J12.1), Level_shifter (U2.11)
CAM/SoM_FSYNC_1V8: BTB_CONN (J1.26), Level_shifter (U2.2)
CAM/SoM_FSYNC_5V: M8_AUX_CONN (J12.2), Level_shifter (U2.13)
IO3/WS_1V8: BTB_CONN (J1.23), Level_shifter (U2.5)
IO3/WS_5V: M8_AUX_CONN (J12.7), Level_shifter (U2.10)
MD1_N: M12_ETH_CONN (J7.3), BTB_CONN (J1.3)
MD1_P: M12_ETH_CONN (J7.2), BTB_CONN (J1.2)
MD2_N: M12_ETH_CONN (J7.6), BTB_CONN (J1.6)
MD2_P: M12_ETH_CONN (J7.5), BTB_CONN (J1.5)
MD3_N: M12_ETH_CONN (J7.9), BTB_CONN (J1.9)
MD3_P: M12_ETH_CONN (J7.8), BTB_CONN (J1.8)
MD4_N: M12_ETH_CONN (J7.12), BTB_CONN (J1.12)
MD4_P: M12_ETH_CONN (J7.11), BTB_CONN (J1.11)
STRB/I2S_SCK_1V8: BTB_CONN (J1.25), Level_shifter (U2.3)
STRB/I2S_SCK_5V: M8_AUX_CONN (J12.6), Level_shifter (U2.12)
USB_D_N: M8_AUX_CONN (D15.2 D15.9 J12.4), BTB_CONN (J1.21)
USB_D_P: M8_AUX_CONN (D15.1 D15.10 J12.3), BTB_CONN (J1.20)

## Assembly variants
Production_MX: not fitted C125 R116 R136 R137 U23
Production_KeemBay: not fitted Q19 R116 R136 R137 R138